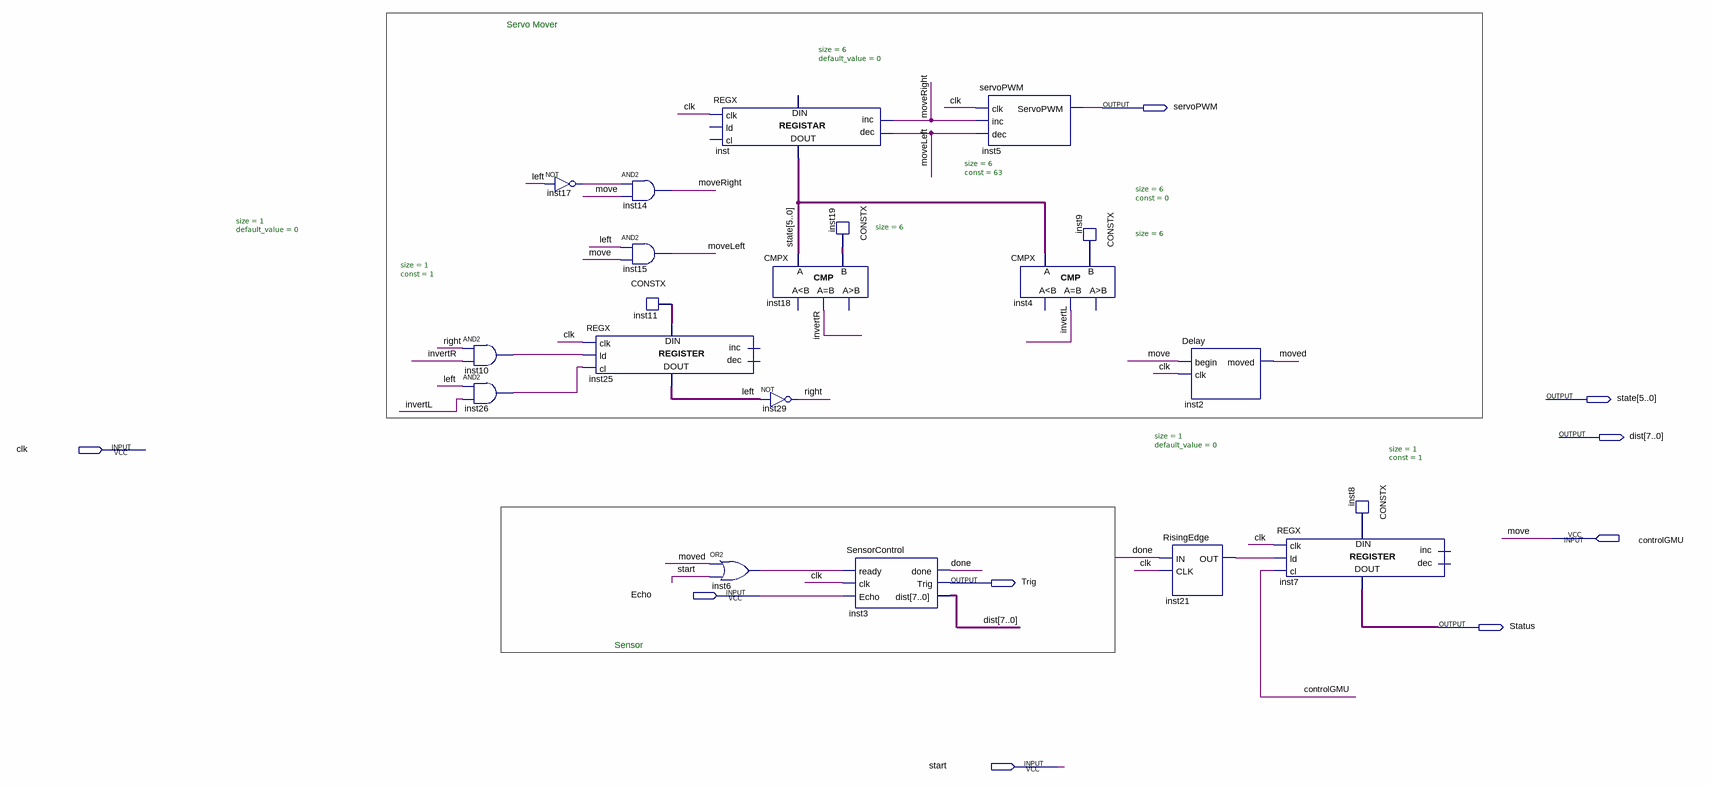
[diagram p0: schematic sheet]
// Quartus schematic PeripheralControl.bdf as structural Verilog: 20 symbols, 9 pins
module PeripheralControl (
  input  clk,
  input  controlGMU,
  input  Echo,
  input  start,
  output servoPWM,
  output [5:0] state,
  output [7:0] \dist ,
  output Trig,
  output Status
);

  wire done, inst6_out, inst8_data, inst10_out, inst11_data, inst17_out, inst21_out, inst26_out, invertL,
       invertR, left, moved, moveLeft, moveRight, right;
  wire [5:0] inst9_data, inst19_data;

  and inst10 (inst10_out, right, invertR);
  and inst26 (inst26_out, left, invertL);
  not inst17 (inst17_out, left);
  REGX #(.size(1), .default_value(0)) inst25 (
    .clk(clk), .ld(inst10_out), .cl(inst26_out), .data_in(inst11_data), .data_out(left));  // open: inc, dec
  and inst14 (moveRight, inst17_out, controlGMU);
  and inst15 (moveLeft, left, controlGMU);
  CONSTX #(.size(1), .\const (1)) inst11 (.data(inst11_data));
  REGX #(.size(6), .default_value(0)) inst (
    .clk(clk), .inc(moveRight), .dec(moveLeft), .data_out(state));  // open: ld, cl, data_in
  or inst6 (inst6_out, moved, start);
  CMPX #(.size(6)) inst18 (.A(state), .B(inst19_data), .eq(invertR));  // open: ls, gr
  not inst29 (right, left);
  CONSTX #(.size(6), .\const (63)) inst19 (.data(inst19_data));
  SensorControl inst3 (.ready(inst6_out), .clk(clk), .Echo(Echo), .done(done), .Trig(Trig), .\dist (\dist ));
  servoPWM inst5 (.clk(clk), .inc(moveRight), .dec(moveLeft), .ServoPWM(servoPWM));
  CMPX #(.size(6)) inst4 (.A(state), .B(inst9_data), .eq(invertL));  // open: ls, gr
  CONSTX #(.size(6), .\const (0)) inst9 (.data(inst9_data));
  RisingEdge inst21 (.IN(done), .CLK(clk), .OUT(inst21_out));
  Delay inst2 (.\begin (controlGMU), .clk(clk), .moved(moved));
  REGX #(.size(1), .default_value(0)) inst7 (
    .clk(clk), .ld(inst21_out), .cl(controlGMU), .data_in(inst8_data), .data_out(Status));  // open: inc, dec
  CONSTX #(.size(1), .\const (1)) inst8 (.data(inst8_data));

  // Other names for the same wires on the sheet: move = controlGMU

  // Notes on the sheet:
  //   Servo Mover
  //   Sensor
endmodule
